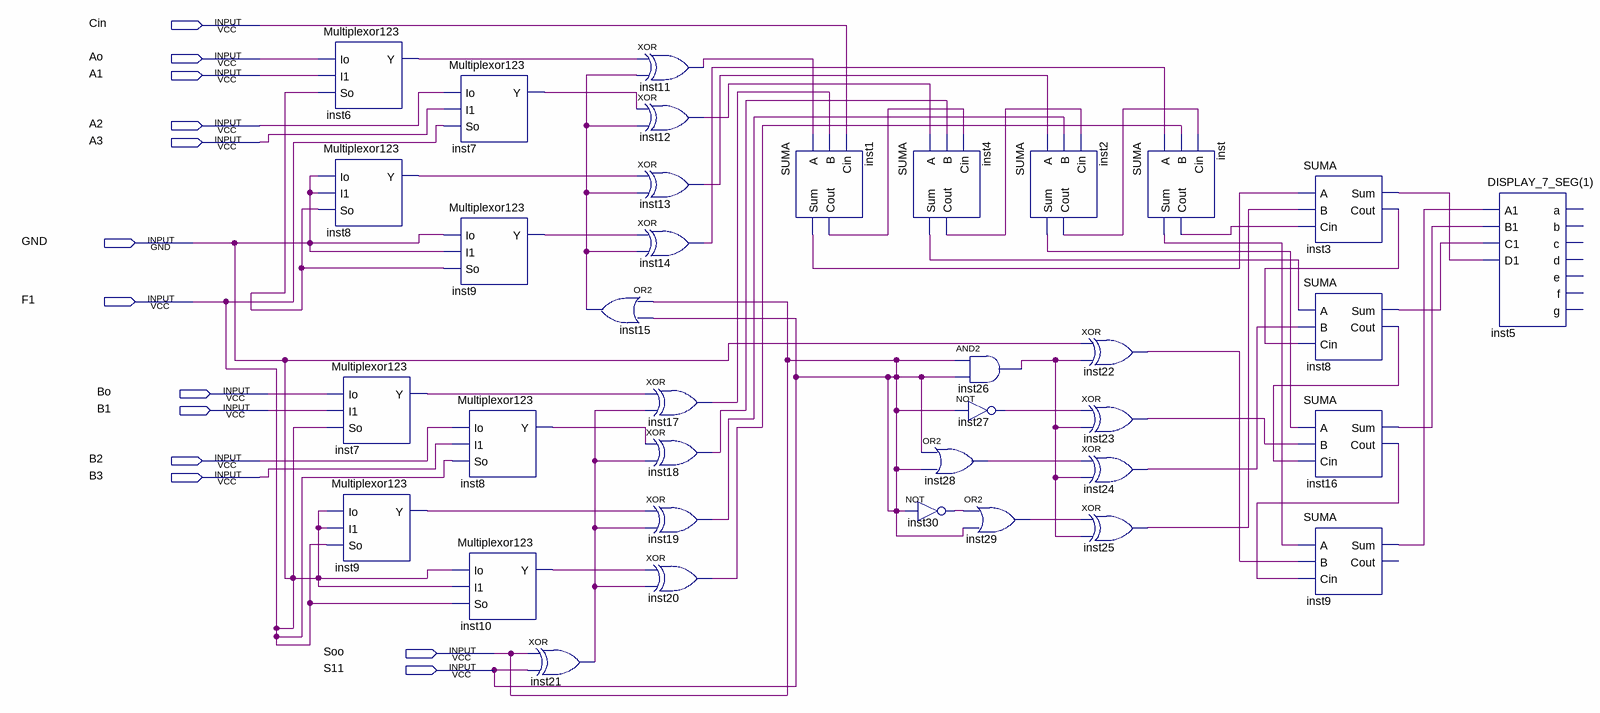
[diagram p0: schematic sheet]
// Quartus schematic Practica_ALU.bdf as structural Verilog: 36 symbols, 13 pins
module Practica_ALU (
  input  Cin,
  input  Ao,
  input  A1,
  input  A2,
  input  A3,
  input  GND,
  input  F1,
  input  Bo,
  input  B1,
  input  B2,
  input  B3,
  input  Soo,
  input  S11
);

  wire inst1_cout, inst1_sum, inst2_cout, inst2_sum, inst3_cout, inst3_sum, inst4_cout, inst4_sum, inst6_y,
       inst7_y, inst7_y_2, inst8_cout, inst8_sum, inst8_y, inst8_y_2, inst9_sum, inst9_y, inst9_y_2,
       inst10_y, inst11_out, inst12_out, inst13_out, inst14_out, inst15_out, inst16_cout, inst16_sum,
       inst17_out, inst18_out, inst19_out, inst20_out, inst21_out, inst22_out, inst23_out, inst24_out,
       inst25_out, inst26_out, inst27_out, inst28_out, inst29_out, inst30_out, inst_cout, inst_sum, undriven;

  Multiplexor123 inst6 (.Io(Ao), .I1(A1), .So(undriven), .Y(inst6_y));
  Multiplexor123 inst8 (.Io(F1), .I1(F1), .So(undriven), .Y(inst8_y));
  Multiplexor123 inst7 (.Io(Bo), .I1(B1), .So(F1), .Y(inst7_y_2));
  Multiplexor123 inst9 (.Io(F1), .I1(F1), .So(F1), .Y(inst9_y_2));
  Multiplexor123 inst7_dup2 (.Io(A2), .I1(A3), .So(F1), .Y(inst7_y));
  Multiplexor123 inst9_dup2 (.Io(F1), .I1(F1), .So(undriven), .Y(inst9_y));
  Multiplexor123 inst8_dup2 (.Io(B2), .I1(B3), .So(F1), .Y(inst8_y_2));
  Multiplexor123 inst10 (.Io(F1), .I1(F1), .So(F1), .Y(inst10_y));
  xor inst21 (inst21_out, S11, S11);
  or inst15 (inst15_out, S11, S11);
  xor inst11 (inst11_out, inst6_y, inst15_out);
  xor inst12 (inst12_out, inst7_y, inst15_out);
  xor inst13 (inst13_out, inst8_y, inst15_out);
  xor inst14 (inst14_out, inst9_y, inst15_out);
  xor inst17 (inst17_out, inst7_y_2, inst21_out);
  xor inst18 (inst18_out, inst8_y_2, inst21_out);
  xor inst19 (inst19_out, inst9_y_2, inst21_out);
  xor inst20 (inst20_out, inst10_y, inst21_out);
  SUMA inst1 (.A(inst11_out), .B(inst17_out), .Cin(Cin), .Sum(inst1_sum), .Cout(inst1_cout));
  SUMA inst4 (.A(inst12_out), .B(inst18_out), .Cin(inst1_cout), .Sum(inst4_sum), .Cout(inst4_cout));
  and inst26 (inst26_out, S11, S11);
  not inst27 (inst27_out, S11);
  or inst28 (inst28_out, S11, S11);
  or inst29 (inst29_out, inst30_out, S11);
  not inst30 (inst30_out, S11);
  SUMA inst2 (.A(inst13_out), .B(inst19_out), .Cin(inst4_cout), .Sum(inst2_sum), .Cout(inst2_cout));
  xor inst22 (inst22_out, F1, inst26_out);
  xor inst23 (inst23_out, inst27_out, inst26_out);
  xor inst24 (inst24_out, inst28_out, inst26_out);
  xor inst25 (inst25_out, inst29_out, inst26_out);
  SUMA inst (.A(inst14_out), .B(inst20_out), .Cin(inst2_cout), .Sum(inst_sum), .Cout(inst_cout));
  SUMA inst3 (.A(inst1_sum), .B(inst25_out), .Cin(inst_cout), .Sum(inst3_sum), .Cout(inst3_cout));
  SUMA inst8_dup3 (.A(inst4_sum), .B(inst24_out), .Cin(inst3_cout), .Sum(inst8_sum), .Cout(inst8_cout));
  SUMA inst16 (.A(inst2_sum), .B(inst23_out), .Cin(inst8_cout), .Sum(inst16_sum), .Cout(inst16_cout));
  SUMA inst9_dup3 (.A(inst_sum), .B(inst22_out), .Cin(inst16_cout), .Sum(inst9_sum));  // open: Cout
  \DISPLAY_7_SEG(1)  inst5 (
    .A1(inst9_sum), .B1(inst16_sum), .C1(inst8_sum), .D1(inst3_sum));  // open: a, b, c, d, e, f, g

  assign GND = F1;
  assign Soo = S11;
endmodule
